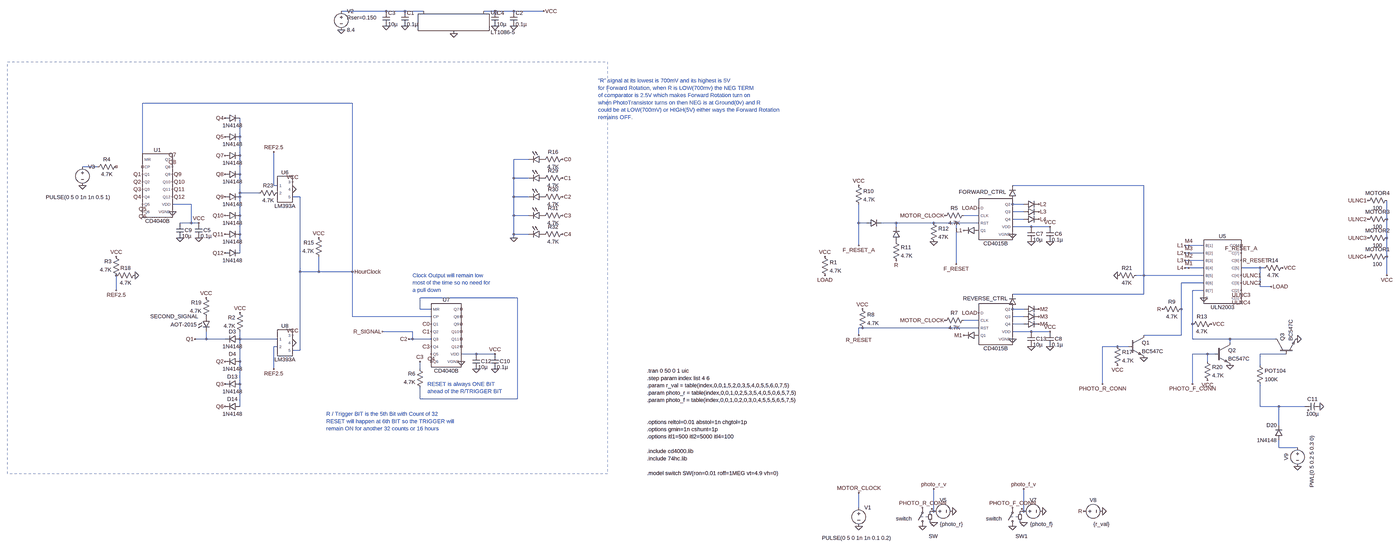
[diagram p0: schematic Draft5_CompleteULN2003_use.asc, whole sheet]
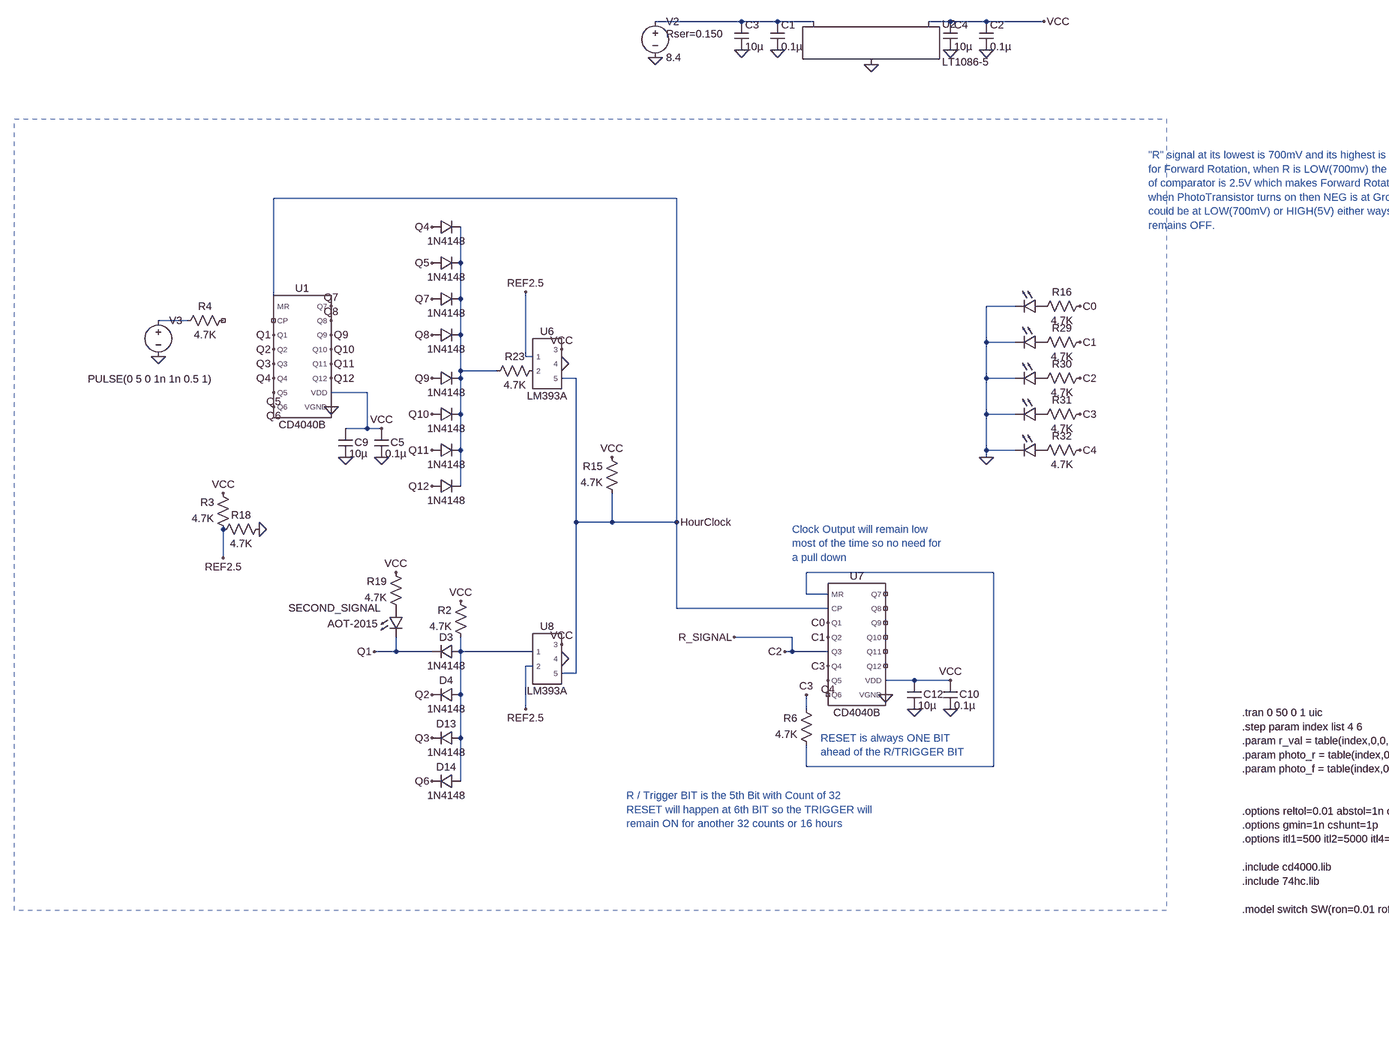
[diagram p1: schematic Draft5_CompleteULN2003_use.asc, part, row 1 of 1, column 1 of 2]
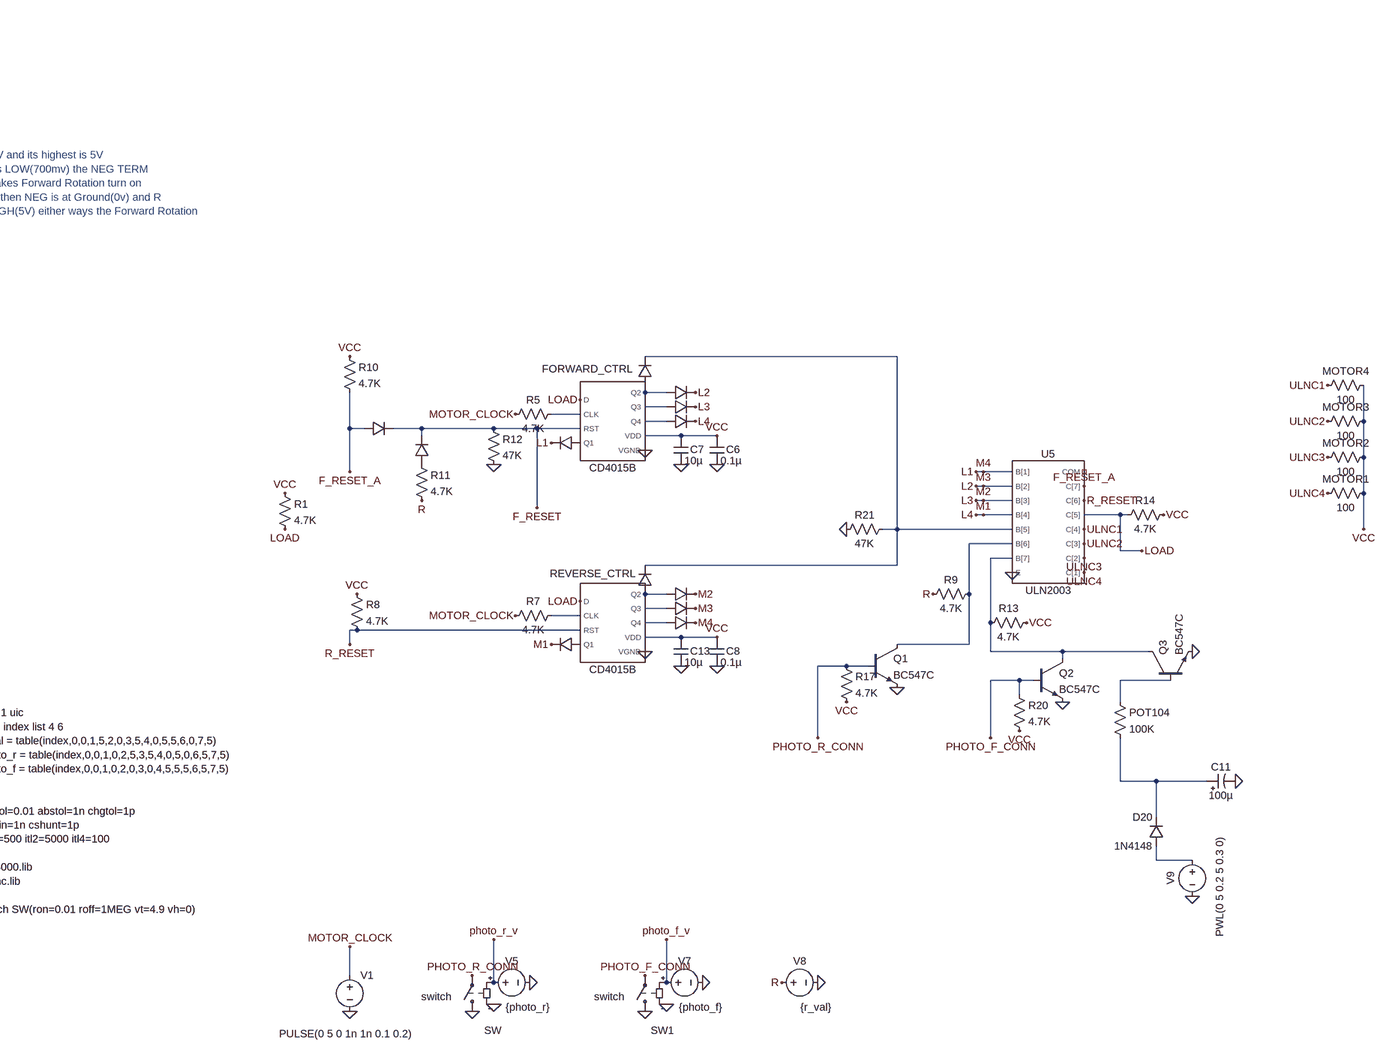
[diagram p2: schematic Draft5_CompleteULN2003_use.asc, part, row 1 of 1, column 2 of 2]
Draft5_CompleteULN2003_use.asc, the LTspice schematic file:
Version 4
SHEET 1 3268 2312
WIRE -1248 -1328 -1440 -1328
WIRE -1168 -1328 -1248 -1328
WIRE -1088 -1328 -1168 -1328
WIRE -784 -1328 -832 -1328
WIRE -704 -1328 -784 -1328
WIRE -576 -1328 -704 -1328
WIRE -1392 -448 -2288 -448
WIRE -1872 -304 -1872 -384
WIRE -1872 -224 -1872 -304
WIRE -2288 -208 -2288 -448
WIRE -640 -208 -704 -208
WIRE -2480 -176 -2544 -176
WIRE -1872 -144 -1872 -224
WIRE -704 -128 -704 -208
WIRE -640 -128 -704 -128
WIRE -1728 -96 -1728 -240
WIRE -1712 -96 -1728 -96
WIRE 1984 -96 1424 -96
WIRE -1872 -64 -1872 -144
WIRE -1792 -64 -1872 -64
WIRE -1872 -48 -1872 -64
WIRE -1616 -48 -1648 -48
WIRE -704 -48 -704 -128
WIRE -640 -48 -704 -48
WIRE -2080 -16 -2160 -16
WIRE 1424 -16 1424 -32
WIRE 1472 -16 1424 -16
WIRE 1472 16 1424 16
WIRE -1872 32 -1872 -48
WIRE -704 32 -704 -48
WIRE -640 32 -704 32
WIRE 1280 32 1216 32
WIRE 1472 48 1424 48
WIRE 3056 48 3056 -32
WIRE -2080 64 -2080 -16
WIRE -2080 64 -2128 64
WIRE -2048 64 -2080 64
WIRE 768 64 768 -16
WIRE 800 64 768 64
WIRE 928 64 864 64
WIRE 1088 64 928 64
WIRE 1184 64 1088 64
WIRE 1280 64 1184 64
WIRE 928 80 928 64
WIRE 1504 80 1424 80
WIRE 1584 80 1504 80
WIRE -1872 112 -1872 32
WIRE -704 112 -704 32
WIRE -640 112 -704 112
WIRE -704 128 -704 112
WIRE 3056 128 3056 48
WIRE 768 160 768 64
WIRE 2176 160 2160 160
WIRE 2240 160 2176 160
WIRE -1872 192 -1872 112
WIRE 2176 192 2160 192
WIRE 2240 192 2176 192
WIRE 3056 208 3056 128
WIRE 2176 224 2160 224
WIRE 2240 224 2176 224
WIRE 1184 240 1184 64
WIRE 2176 256 2160 256
WIRE 2240 256 2176 256
WIRE 2480 256 2400 256
WIRE 2496 256 2480 256
WIRE -1616 272 -1616 -48
WIRE -1536 272 -1536 208
WIRE -1536 272 -1616 272
WIRE -1392 272 -1392 -448
WIRE -1392 272 -1536 272
WIRE 1984 288 1984 -96
WIRE 1984 288 1952 288
WIRE 2240 288 1984 288
WIRE 3056 288 3056 208
WIRE 2240 320 2144 320
WIRE 2480 336 2480 256
WIRE 2528 336 2480 336
WIRE -2400 352 -2400 288
WIRE 2240 352 2192 352
WIRE 1984 368 1984 288
WIRE 1984 368 1424 368
WIRE -688 384 -1104 384
WIRE -1104 432 -1104 384
WIRE -1056 432 -1104 432
WIRE 1472 432 1424 432
WIRE 2144 432 2144 320
WIRE -1392 464 -1392 272
WIRE -1056 464 -1392 464
WIRE 1472 464 1424 464
WIRE 1280 480 1216 480
WIRE 1472 496 1424 496
WIRE 2192 496 2192 352
WIRE 784 512 768 512
WIRE 1280 512 784 512
WIRE -1136 528 -1264 528
WIRE 1504 528 1424 528
WIRE 1584 528 1504 528
WIRE 768 544 768 512
WIRE 2144 544 2144 432
WIRE 2144 544 1984 544
WIRE -2016 560 -2016 528
WIRE -2016 560 -2064 560
WIRE -1936 560 -2016 560
WIRE -1872 560 -1872 528
WIRE -1712 560 -1872 560
WIRE -1136 560 -1136 528
WIRE -1136 560 -1152 560
WIRE -1056 560 -1136 560
WIRE 2192 560 2192 496
WIRE 2352 560 2192 560
WIRE 2544 560 2352 560
WIRE 2352 576 2352 560
WIRE -1712 592 -1728 592
WIRE 1872 592 1808 592
WIRE 1920 592 1872 592
WIRE -1616 608 -1616 272
WIRE -1616 608 -1648 608
WIRE -864 624 -928 624
WIRE -784 624 -864 624
WIRE 2256 624 2192 624
WIRE 2288 624 2256 624
WIRE 2592 624 2480 624
WIRE -1872 656 -1872 560
WIRE 2256 656 2256 624
WIRE 2480 672 2480 624
WIRE -1728 688 -1728 592
WIRE -1104 688 -1104 656
WIRE -1872 752 -1872 656
WIRE 1808 752 1808 592
WIRE 2192 752 2192 624
WIRE -1104 816 -1104 768
WIRE -688 816 -688 384
WIRE -688 816 -1104 816
WIRE -1872 848 -1872 752
WIRE 2480 848 2480 752
WIRE 2560 848 2480 848
WIRE 2672 848 2560 848
WIRE 2560 928 2560 848
WIRE 2560 1024 2560 992
WIRE 2640 1024 2560 1024
WIRE 768 1280 768 1216
WIRE 1088 1296 1088 1200
WIRE 1472 1296 1472 1200
FLAG -1248 -1264 0
FLAG -1168 -1264 0
FLAG -960 -1232 0
FLAG -784 -1264 0
FLAG -704 -1264 0
FLAG -1440 -1248 0
FLAG -576 -1328 VCC
FLAG -2160 16 0
FLAG -1936 -384 Q4
FLAG -1936 -304 Q5
FLAG -2288 -144 Q1
FLAG -2288 -112 Q2
FLAG -2288 -80 Q3
FLAG -2288 -48 Q4
FLAG -2288 -16 Q5
FLAG -2288 16 Q6
FLAG -2160 -208 Q7
FLAG -2160 -176 Q8
FLAG -2160 -144 Q9
FLAG -2160 -112 Q10
FLAG -2160 -80 Q11
FLAG -2160 -48 Q12
FLAG 1040 1360 0
FLAG -2064 560 Q1
FLAG -1936 656 Q2
FLAG -1936 752 Q3
FLAG -1936 848 Q6
FLAG -1936 -224 Q7
FLAG -1936 -144 Q8
FLAG -1936 -48 Q9
FLAG -1936 32 Q10
FLAG -1936 112 Q11
FLAG -1936 192 Q12
FLAG 1088 1344 0
FLAG -2544 -96 0
FLAG -2400 208 VCC
FLAG -1872 448 VCC
FLAG -2048 64 VCC
FLAG -2128 128 0
FLAG -2048 128 0
FLAG -864 688 0
FLAG -784 688 0
FLAG -928 656 0
FLAG -2016 384 VCC
FLAG -1056 496 C0
FLAG -1056 528 C1
FLAG -1056 592 C3
FLAG -1056 624 C4
FLAG -784 624 VCC
FLAG 1504 144 0
FLAG 1584 144 0
FLAG 1584 80 VCC
FLAG 1424 112 0
FLAG 1536 -16 L2
FLAG 1536 48 L4
FLAG 1504 592 0
FLAG 1584 592 0
FLAG 1584 528 VCC
FLAG 1424 560 0
FLAG 1536 432 M2
FLAG 1536 464 M3
FLAG 1536 496 M4
FLAG 1536 16 L3
FLAG 2240 384 0
FLAG 768 1360 0
FLAG 768 1216 MOTOR_CLOCK
FLAG 3056 288 VCC
FLAG 2160 160 L1
FLAG 2160 192 L2
FLAG 2160 224 L3
FLAG 2160 256 L4
FLAG 2176 160 M4
FLAG 2176 192 M3
FLAG 2176 224 M2
FLAG 2176 256 M1
FLAG -1152 560 C2
FLAG -2320 288 0
FLAG -1648 -112 VCC
FLAG -1648 -80 0
FLAG -1648 544 VCC
FLAG -1648 576 0
FLAG -1536 128 VCC
FLAG -1392 272 HourClock
FLAG -496 -208 C0
FLAG -496 -128 C1
FLAG -496 -48 C2
FLAG -496 32 C3
FLAG -496 112 C4
FLAG -1104 656 C3
FLAG -2400 352 REF2.5
FLAG -1728 -240 REF2.5
FLAG -1728 688 REF2.5
FLAG 1168 1296 0
FLAG -1264 528 R_SIGNAL
FLAG -704 128 0
FLAG 2976 -32 ULNC1
FLAG 2976 48 ULNC2
FLAG 2976 128 ULNC3
FLAG 2976 208 ULNC4
FLAG 2400 384 ULNC4
FLAG 2400 352 ULNC3
FLAG 2400 320 ULNC2
FLAG 2400 288 ULNC1
FLAG 624 208 VCC
FLAG 624 288 LOAD
FLAG 2528 336 LOAD
FLAG 1280 0 LOAD
FLAG 1280 448 LOAD
FLAG 1136 32 MOTOR_CLOCK
FLAG 1136 480 MOTOR_CLOCK
FLAG 1216 96 L1
FLAG 1216 544 M1
FLAG 784 432 VCC
FLAG 768 544 R_RESET
FLAG 2400 224 R_RESET
FLAG 2064 432 R
FLAG 1808 752 PHOTO_R_CONN
FLAG 768 -96 VCC
FLAG 928 224 R
FLAG 2400 192 F_RESET_A
FLAG 2272 496 VCC
FLAG 2192 752 PHOTO_F_CONN
FLAG 1040 1280 PHOTO_R_CONN
FLAG 1424 1360 0
FLAG 1472 1344 0
FLAG 1552 1296 0
FLAG 1424 1280 PHOTO_F_CONN
FLAG 1808 1296 0
FLAG 1728 1296 R
FLAG 1472 1200 photo_f_v
FLAG 1088 1200 photo_r_v
FLAG 768 160 F_RESET_A
FLAG 2736 848 0
FLAG 2640 1104 0
FLAG 2576 256 VCC
FLAG 1088 144 0
FLAG 1984 640 0
FLAG 1872 672 VCC
FLAG 2256 736 VCC
FLAG 2352 672 0
FLAG 2640 560 0
FLAG 1184 240 F_RESET
FLAG 1872 288 0
SYMBOL CD4040B -2224 -96 R0
WINDOW 39 0 160 Invisible 2
SYMATTR InstName U1
SYMATTR Value2 vdd=5 speed=1 tripdt=5n
SYMBOL PowerProducts\\LT1086-5 -960 -1328 R0
SYMATTR InstName U2
SYMBOL cap -1184 -1328 R0
SYMATTR InstName C1
SYMATTR Value 0.1µ
SYMATTR SpiceLine V=25 Irms=0 Rser=0.025 Lser=800p mfg="Würth Elektronik" pn="885012206071 WCAP-CSGP 0603" type="X7R"
SYMBOL cap -1264 -1328 R0
SYMATTR InstName C3
SYMATTR Value 10µ
SYMATTR SpiceLine V=25 Irms=0 Rser=0 Lser=0 mfg="Murata" pn="GRM21BR61E106KA73" type="X5R"
SYMBOL cap -720 -1328 R0
SYMATTR InstName C2
SYMATTR Value 0.1µ
SYMATTR SpiceLine V=25 Irms=0 Rser=0.025 Lser=800p mfg="Würth Elektronik" pn="885012206071 WCAP-CSGP 0603" type="X7R"
SYMBOL cap -800 -1328 R0
SYMATTR InstName C4
SYMATTR Value 10µ
SYMATTR SpiceLine V=25 Irms=0 Rser=0 Lser=0 mfg="Murata" pn="GRM21BR61E106KA73" type="X5R"
SYMBOL voltage -1440 -1344 R0
WINDOW 123 0 0 Left 0
WINDOW 39 24 44 Left 2
SYMATTR SpiceLine Rser=0.150
SYMATTR InstName V2
SYMATTR Value 8.4
SYMBOL diode -1936 -368 R270
WINDOW 0 32 32 Invisible 2
WINDOW 3 0 32 VBottom 2
SYMATTR InstName D5
SYMATTR Value 1N4148
SYMBOL diode -1936 -288 R270
WINDOW 0 32 32 Invisible 2
WINDOW 3 0 32 VBottom 2
SYMATTR InstName D6
SYMATTR Value 1N4148
SYMBOL diode -1936 -208 R270
WINDOW 0 32 32 Invisible 2
WINDOW 3 0 32 VBottom 2
SYMATTR InstName D7
SYMATTR Value 1N4148
SYMBOL diode -1936 -128 R270
WINDOW 0 32 32 Invisible 2
WINDOW 3 0 32 VBottom 2
SYMATTR InstName D8
SYMATTR Value 1N4148
SYMBOL diode -1936 -32 R270
WINDOW 0 32 32 Invisible 2
WINDOW 3 0 32 VBottom 2
SYMATTR InstName D9
SYMATTR Value 1N4148
SYMBOL diode -1936 48 R270
WINDOW 0 32 32 Invisible 2
WINDOW 3 0 32 VBottom 2
SYMATTR InstName D10
SYMATTR Value 1N4148
SYMBOL diode -1936 128 R270
WINDOW 0 32 32 Invisible 2
WINDOW 3 0 32 VBottom 2
SYMATTR InstName D11
SYMATTR Value 1N4148
SYMBOL diode -1936 208 R270
WINDOW 0 32 32 Invisible 2
WINDOW 3 0 32 VBottom 2
SYMATTR InstName D12
SYMATTR Value 1N4148
SYMBOL res -2384 -192 R90
WINDOW 0 0 56 VBottom 2
WINDOW 3 32 56 VTop 2
SYMATTR InstName R4
SYMATTR Value 4.7K
SYMBOL ULN2003 2320 272 R0
SYMATTR InstName U5
SYMBOL sw 1040 1376 R180
WINDOW 3 46 49 Left 2
WINDOW 0 -65 -26 Left 2
SYMATTR Value switch
SYMATTR InstName SW
SYMBOL voltage -2544 -192 R0
WINDOW 3 -157 146 Left 2
WINDOW 123 0 0 Left 0
WINDOW 39 0 0 Left 0
SYMATTR Value PULSE(0 5 0 1n 1n 0.5 1)
SYMATTR InstName V3
SYMBOL res -2384 304 R180
WINDOW 0 36 76 Left 2
WINDOW 3 36 40 Left 2
SYMATTR InstName R3
SYMATTR Value 4.7K
SYMBOL diode -1872 544 R90
WINDOW 0 0 32 VBottom 2
WINDOW 3 32 32 VTop 2
SYMATTR InstName D3
SYMATTR Value 1N4148
SYMBOL diode -1872 640 R90
WINDOW 0 0 32 VBottom 2
WINDOW 3 32 32 VTop 2
SYMATTR InstName D4
SYMATTR Value 1N4148
SYMBOL diode -1872 736 R90
WINDOW 0 0 32 VBottom 2
WINDOW 3 32 32 VTop 2
SYMATTR InstName D13
SYMATTR Value 1N4148
SYMBOL diode -1872 832 R90
WINDOW 0 0 32 VBottom 2
WINDOW 3 32 32 VTop 2
SYMATTR InstName D14
SYMATTR Value 1N4148
SYMBOL res -1856 544 R180
WINDOW 0 36 76 Left 2
WINDOW 3 36 40 Left 2
SYMATTR InstName R2
SYMATTR Value 4.7K
SYMBOL res -1520 224 R180
WINDOW 0 36 76 Left 2
WINDOW 3 36 40 Left 2
SYMATTR InstName R15
SYMATTR Value 4.7K
SYMBOL CD4040B -992 544 R0
WINDOW 39 0 160 Invisible 2
SYMATTR InstName U7
SYMATTR Value2 vdd=5 speed=1 tripdt=5n
SYMBOL cap -2064 64 R0
WINDOW 0 36 31 Left 2
SYMATTR InstName C5
SYMATTR Value 0.1µ
SYMATTR SpiceLine V=25 Irms=0 Rser=0.025 Lser=800p mfg="Würth Elektronik" pn="885012206071 WCAP-CSGP 0603" type="X7R"
SYMBOL cap -2144 64 R0
WINDOW 0 36 31 Left 2
SYMATTR InstName C9
SYMATTR Value 10µ
SYMATTR SpiceLine V=25 Irms=0 Rser=0 Lser=0 mfg="Murata" pn="GRM21BR61E106KA73" type="X5R"
SYMBOL cap -800 624 R0
WINDOW 0 36 31 Left 2
SYMATTR InstName C10
SYMATTR Value 0.1µ
SYMATTR SpiceLine V=25 Irms=0 Rser=0.025 Lser=800p mfg="Würth Elektronik" pn="885012206071 WCAP-CSGP 0603" type="X7R"
SYMBOL cap -880 624 R0
WINDOW 0 36 31 Left 2
SYMATTR InstName C12
SYMATTR Value 10µ
SYMATTR SpiceLine V=25 Irms=0 Rser=0 Lser=0 mfg="Murata" pn="GRM21BR61E106KA73" type="X5R"
SYMBOL res -1088 784 R180
WINDOW 0 36 76 Left 2
WINDOW 3 36 40 Left 2
SYMATTR InstName R6
SYMATTR Value 4.7K
SYMBOL res -2000 480 R180
WINDOW 0 36 76 Left 2
WINDOW 3 36 40 Left 2
SYMATTR InstName R19
SYMATTR Value 4.7K
SYMBOL LED -2032 464 R0
WINDOW 0 -223 -1 Left 2
WINDOW 3 -136 34 Left 2
SYMATTR InstName SECOND_SIGNAL
SYMATTR Value AOT-2015
SYMBOL CD4015B 1344 48 R0
WINDOW 39 8 112 Invisible 2
WINDOW 0 -49 -101 Bottom 2
SYMATTR InstName FORWARD_CTRL
SYMATTR Value2 vdd=5 speed=1 tripdt=5n
SYMBOL cap 1568 80 R0
WINDOW 0 36 31 Left 2
SYMATTR InstName C6
SYMATTR Value 0.1µ
SYMATTR SpiceLine V=25 Irms=0 Rser=0.025 Lser=800p mfg="Würth Elektronik" pn="885012206071 WCAP-CSGP 0603" type="X7R"
SYMBOL cap 1488 80 R0
WINDOW 0 36 31 Left 2
SYMATTR InstName C7
SYMATTR Value 10µ
SYMATTR SpiceLine V=25 Irms=0 Rser=0 Lser=0 mfg="Murata" pn="GRM21BR61E106KA73" type="X5R"
SYMBOL CD4015B 1344 496 R0
WINDOW 39 8 112 Invisible 2
WINDOW 0 -36 -94 Bottom 2
SYMATTR InstName REVERSE_CTRL
SYMATTR Value2 vdd=5 speed=1 tripdt=5n
SYMBOL cap 1568 528 R0
WINDOW 0 36 31 Left 2
SYMATTR InstName C8
SYMATTR Value 0.1µ
SYMATTR SpiceLine V=25 Irms=0 Rser=0.025 Lser=800p mfg="Würth Elektronik" pn="885012206071 WCAP-CSGP 0603" type="X7R"
SYMBOL cap 1488 528 R0
WINDOW 0 36 31 Left 2
SYMATTR InstName C13
SYMATTR Value 10µ
SYMATTR SpiceLine V=25 Irms=0 Rser=0 Lser=0 mfg="Murata" pn="GRM21BR61E106KA73" type="X5R"
SYMBOL diode 1472 0 R270
WINDOW 0 32 32 Invisible 2
WINDOW 3 0 32 Invisible 2
SYMATTR InstName D21
SYMATTR Value 1N4148
SYMBOL diode 1472 32 R270
WINDOW 0 32 32 Invisible 2
WINDOW 3 0 32 Invisible 2
SYMATTR InstName D22
SYMATTR Value 1N4148
SYMBOL diode 1472 64 R270
WINDOW 0 32 32 Invisible 2
WINDOW 3 0 32 Invisible 2
SYMATTR InstName D23
SYMATTR Value 1N4148
SYMBOL diode 1472 448 R270
WINDOW 0 32 32 Invisible 2
WINDOW 3 0 32 Invisible 2
SYMATTR InstName D24
SYMATTR Value 1N4148
SYMBOL diode 1472 480 R270
WINDOW 0 32 32 Invisible 2
WINDOW 3 0 32 Invisible 2
SYMATTR InstName D25
SYMATTR Value 1N4148
SYMBOL diode 1472 512 R270
WINDOW 0 32 32 Invisible 2
WINDOW 3 0 32 Invisible 2
SYMATTR InstName D26
SYMATTR Value 1N4148
SYMBOL voltage 768 1264 R0
WINDOW 3 -157 146 Left 2
WINDOW 123 0 0 Left 0
WINDOW 39 0 0 Left 0
SYMATTR Value PULSE(0 5 0 1n 1n 0.1 0.2)
SYMATTR InstName V1
SYMBOL res 3072 192 R90
WINDOW 0 0 56 VBottom 2
WINDOW 3 32 56 VTop 2
SYMATTR InstName MOTOR1
SYMATTR Value 100
SYMBOL res 3072 112 R90
WINDOW 0 0 56 VBottom 2
WINDOW 3 32 56 VTop 2
SYMATTR InstName MOTOR2
SYMATTR Value 100
SYMBOL res 3072 32 R90
WINDOW 0 0 56 VBottom 2
WINDOW 3 32 56 VTop 2
SYMATTR InstName MOTOR3
SYMATTR Value 100
SYMBOL res 3072 -48 R90
WINDOW 0 0 56 VBottom 2
WINDOW 3 32 56 VTop 2
SYMATTR InstName MOTOR4
SYMATTR Value 100
SYMBOL diode 1440 -32 R180
WINDOW 0 24 64 Invisible 2
WINDOW 3 24 0 Invisible 2
SYMATTR InstName D2
SYMATTR Value 1N4148
SYMBOL diode 1440 432 R180
WINDOW 0 24 64 Invisible 2
WINDOW 3 24 0 Invisible 2
SYMATTR InstName D16
SYMATTR Value 1N4148
SYMBOL LM393A -1680 -80 R0
SYMATTR InstName U6
SYMBOL res -2416 304 R270
WINDOW 0 32 56 VTop 2
WINDOW 3 0 56 VBottom 2
SYMATTR InstName R18
SYMATTR Value 4.7K
SYMBOL LM393A -1680 576 R0
SYMATTR InstName U8
SYMBOL LED -576 -224 R90
WINDOW 0 0 32 Invisible 2
WINDOW 3 72 32 Invisible 2
SYMATTR InstName D35
SYMATTR Value NSPW500BS
SYMATTR Description Diode
SYMATTR Type diode
SYMBOL LED -576 -144 R90
WINDOW 0 0 32 Invisible 2
WINDOW 3 72 32 Invisible 2
SYMATTR InstName D36
SYMATTR Value NSPW500BS
SYMATTR Description Diode
SYMATTR Type diode
SYMBOL LED -576 -64 R90
WINDOW 0 0 32 Invisible 2
WINDOW 3 72 32 Invisible 2
SYMATTR InstName D37
SYMATTR Value NSPW500BS
SYMATTR Description Diode
SYMATTR Type diode
SYMBOL LED -576 16 R90
WINDOW 0 0 32 Invisible 2
WINDOW 3 72 32 Invisible 2
SYMATTR InstName D38
SYMATTR Value NSPW500BS
SYMATTR Description Diode
SYMATTR Type diode
SYMBOL LED -576 96 R90
WINDOW 0 0 32 Invisible 2
WINDOW 3 72 32 Invisible 2
SYMATTR InstName D39
SYMATTR Value NSPW500BS
SYMATTR Description Diode
SYMATTR Type diode
SYMBOL res -480 -224 R90
WINDOW 0 0 56 VBottom 2
WINDOW 3 32 56 VTop 2
SYMATTR InstName R16
SYMATTR Value 4.7K
SYMBOL res -480 -144 R90
WINDOW 0 0 56 VBottom 2
WINDOW 3 32 56 VTop 2
SYMATTR InstName R29
SYMATTR Value 4.7K
SYMBOL res -480 -64 R90
WINDOW 0 0 56 VBottom 2
WINDOW 3 32 56 VTop 2
SYMATTR InstName R30
SYMATTR Value 4.7K
SYMBOL res -480 16 R90
WINDOW 0 0 56 VBottom 2
WINDOW 3 32 56 VTop 2
SYMATTR InstName R31
SYMATTR Value 4.7K
SYMBOL res -480 96 R90
WINDOW 0 0 56 VBottom 2
WINDOW 3 32 56 VTop 2
SYMATTR InstName R32
SYMATTR Value 4.7K
SYMBOL res -1696 -80 R90
WINDOW 0 0 56 VBottom 2
WINDOW 3 32 56 VTop 2
SYMATTR InstName R23
SYMATTR Value 4.7K
SYMBOL voltage 1072 1296 R270
WINDOW 0 32 56 VTop 2
WINDOW 3 -39 92 VBottom 2
SYMATTR InstName V5
SYMATTR Value {photo_r}
SYMBOL res 608 192 R0
SYMATTR InstName R1
SYMATTR Value 4.7K
SYMBOL res 1232 16 R90
WINDOW 0 0 56 VBottom 2
WINDOW 3 32 56 VTop 2
SYMATTR InstName R5
SYMATTR Value 4.7K
SYMBOL res 1232 464 R90
WINDOW 0 0 56 VBottom 2
WINDOW 3 32 56 VTop 2
SYMATTR InstName R7
SYMATTR Value 4.7K
SYMBOL diode 1280 80 R90
WINDOW 0 0 32 Invisible 2
WINDOW 3 32 32 Invisible 2
SYMATTR InstName D1
SYMATTR Value 1N4148
SYMBOL diode 1280 528 R90
WINDOW 0 0 32 Invisible 2
WINDOW 3 32 32 Invisible 2
SYMATTR InstName D15
SYMATTR Value 1N4148
SYMBOL res 768 416 R0
SYMATTR InstName R8
SYMATTR Value 4.7K
SYMBOL res 2160 416 R90
WINDOW 0 0 56 VBottom 2
WINDOW 3 32 56 VTop 2
SYMATTR InstName R9
SYMATTR Value 4.7K
SYMBOL res 752 -112 R0
SYMATTR InstName R10
SYMATTR Value 4.7K
SYMBOL res 912 128 R0
SYMATTR InstName R11
SYMATTR Value 4.7K
SYMBOL diode 800 80 R270
WINDOW 0 32 32 Invisible 2
WINDOW 3 0 32 Invisible 2
SYMATTR InstName D18
SYMATTR Value 1N4148
SYMBOL diode 944 144 R180
WINDOW 0 24 64 Invisible 2
WINDOW 3 24 0 Invisible 2
SYMATTR InstName D19
SYMATTR Value 1N4148
SYMBOL res 1072 48 R0
SYMATTR InstName R12
SYMATTR Value 47K
SYMBOL res 2288 480 R90
WINDOW 0 0 56 VBottom 2
WINDOW 3 32 56 VTop 2
SYMATTR InstName R13
SYMATTR Value 4.7K
SYMBOL sw 1424 1376 R180
WINDOW 3 46 49 Left 2
WINDOW 0 -65 -26 Left 2
SYMATTR Value switch
SYMATTR InstName SW1
SYMBOL voltage 1456 1296 R270
WINDOW 0 32 56 VTop 2
WINDOW 3 -39 92 VBottom 2
SYMATTR InstName V7
SYMATTR Value {photo_f}
SYMBOL voltage 1712 1296 R270
WINDOW 0 32 56 VTop 2
WINDOW 3 -39 92 VBottom 2
SYMATTR InstName V8
SYMATTR Value {r_val}
SYMBOL polcap 2672 864 R270
WINDOW 0 32 32 VTop 2
WINDOW 3 0 32 VBottom 2
SYMATTR InstName C11
SYMATTR Value 100µ
SYMATTR SpiceLine V=25 Irms=520m Rser=0.087 Lser=27.6n
SYMBOL voltage 2640 1008 R0
WINDOW 0 -32 56 VBottom 2
WINDOW 3 46 74 VTop 2
WINDOW 123 0 0 Left 0
WINDOW 39 0 0 Left 0
SYMATTR InstName V9
SYMATTR Value PWL(0 5 0.2 5 0.3 0)
SYMBOL diode 2576 992 R180
WINDOW 0 24 64 Left 2
WINDOW 3 24 0 Left 2
SYMATTR InstName D20
SYMATTR Value 1N4148
SYMBOL res 2592 240 R90
WINDOW 0 0 56 VBottom 2
WINDOW 3 32 56 VTop 2
SYMATTR InstName R14
SYMATTR Value 4.7K
SYMBOL res 2464 656 R0
SYMATTR InstName POT104
SYMATTR Value 100K
SYMBOL npn 1920 544 R0
SYMATTR InstName Q1
SYMATTR Value BC547C
SYMBOL res 1856 576 R0
SYMATTR InstName R17
SYMATTR Value 4.7K
SYMBOL npn 2288 576 R0
SYMATTR InstName Q2
SYMATTR Value BC547C
SYMBOL res 2240 640 R0
SYMATTR InstName R20
SYMATTR Value 4.7K
SYMBOL npn 2544 624 R270
SYMATTR InstName Q3
SYMATTR Value BC547C
SYMBOL res 1968 272 R90
WINDOW 0 0 56 VBottom 2
WINDOW 3 32 56 VTop 2
SYMATTR InstName R21
SYMATTR Value 47K
TEXT -136 696 Left 2 !.tran 0 50 0 1 uic\n.step param index list 4 6\n.param r_val = table(index,0,0,1,5,2,0,3,5,4,0,5,5,6,0,7,5)\n.param photo_r = table(index,0,0,1,0,2,5,3,5,4,0,5,0,6,5,7,5)\n.param photo_f = table(index,0,0,1,0,2,0,3,0,4,5,5,5,6,5,7,5)\n \n \n.options reltol=0.01 abstol=1n chgtol=1p\n.options gmin=1n cshunt=1p\n.options itl1=500 itl2=5000 itl4=100\n \n.include cd4000.lib\n.include 74hc.lib\n \n.model switch SW(ron=0.01 roff=1MEG vt=4.9 vh=0)
TEXT -1504 880 Left 2 ;R / Trigger BIT is the 5th Bit with Count of 32 \nRESET will happen at 6th BIT so the TRIGGER will \nremain ON for another 32 counts or 16 hours
TEXT -1072 752 Left 2 ;RESET is always ONE BIT \nahead of the R/TRIGGER BIT
TEXT -1136 288 Left 2 ;Clock Output will remain low \nmost of the time so no need for \na pull down
TEXT -344 -544 Left 2 ;"R" signal at its lowest is 700mV and its highest is 5V\nfor Forward Rotation, when R is LOW(700mv) the NEG TERM \nof comparator is 2.5V which makes Forward Rotation turn on \nwhen PhotoTransistor turns on then NEG is at Ground(0v) and R\ncould be at LOW(700mV) or HIGH(5V) either ways the Forward Rotation\nremains OFF.
RECTANGLE Normal -304 1136 -2864 -624 2

The netlist it stands for:
* Draft5_CompleteULN2003_use.asc
XU1 HourClock NC_01 Q1 Q2 Q3 Q4 Q5 Q6 Q7 Q8 Q9 Q10 Q11 Q12 VCC 0 CD4040B vdd=5 speed=1 tripdt=5n vdd1={vdd} speed1={speed} tripdt1={tripdt}  ; pins MR CP Q1 Q2 Q3 Q4 Q5 Q6 Q7 Q8 Q9 Q10 Q11 Q12 VDD VGND
XU2 0 VCC N001 LT1086-5
C1 N001 0 0.1µ V=25 Irms=0 Rser=0.025 Lser=800p mfg="Würth Elektronik" pn="885012206071 WCAP-CSGP 0603" type="X7R"
C3 N001 0 10µ V=25 Irms=0 Rser=0 Lser=0 mfg="Murata" pn="GRM21BR61E106KA73" type="X5R"
C2 VCC 0 0.1µ V=25 Irms=0 Rser=0.025 Lser=800p mfg="Würth Elektronik" pn="885012206071 WCAP-CSGP 0603" type="X7R"
C4 VCC 0 10µ V=25 Irms=0 Rser=0 Lser=0 mfg="Murata" pn="GRM21BR61E106KA73" type="X5R"
V2 N001 0 8.4 Rser=0.150
D5 Q4 N002 1N4148
D6 Q5 N002 1N4148
D7 Q7 N002 1N4148
D8 Q8 N002 1N4148
D9 Q9 N002 1N4148
D10 Q10 N002 1N4148
D11 Q11 N002 1N4148
D12 Q12 N002 1N4148
R4 NC_02 N003 4.7K
XU5 L1 M3 L3 M1 N004 N009 N010 0 NC_03 F_RESET_A R_RESET LOAD ULNC1 ULNC2 ULNC3 ULNC4 ULN2003  ; pins B[1] B[2] B[3] B[4] B[5] B[6] B[7] E COM C[7] C[6] C[5] C[4] C[3] C[2] C[1]
SW 0 PHOTO_R_CONN photo_r_v 0 switch
V3 N003 0 PULSE(0 5 0 1n 1n 0.5 1)
R3 REF2.5 VCC 4.7K
D3 N016 Q1 1N4148
D4 N016 Q2 1N4148
D13 N016 Q3 1N4148
D14 N016 Q6 1N4148
R2 N016 VCC 4.7K
R15 HourClock VCC 4.7K
XU7 N011 HourClock C0 C1 R_SIGNAL C3 C4 NC_04 NC_05 NC_06 NC_07 NC_08 NC_09 NC_10 VCC 0 CD4040B vdd=5 speed=1 tripdt=5n vdd1={vdd} speed1={speed} tripdt1={tripdt}  ; pins MR CP Q1 Q2 Q3 Q4 Q5 Q6 Q7 Q8 Q9 Q10 Q11 Q12 VDD VGND
C5 VCC 0 0.1µ V=25 Irms=0 Rser=0.025 Lser=800p mfg="Würth Elektronik" pn="885012206071 WCAP-CSGP 0603" type="X7R"
C9 VCC 0 10µ V=25 Irms=0 Rser=0 Lser=0 mfg="Murata" pn="GRM21BR61E106KA73" type="X5R"
C10 VCC 0 0.1µ V=25 Irms=0 Rser=0.025 Lser=800p mfg="Würth Elektronik" pn="885012206071 WCAP-CSGP 0603" type="X7R"
C12 VCC 0 10µ V=25 Irms=0 Rser=0 Lser=0 mfg="Murata" pn="GRM21BR61E106KA73" type="X5R"
R6 N011 C3 4.7K
R19 P001 VCC 4.7K
D§SECOND_SIGNAL P001 Q1 AOT-2015
XFORWARD_CTRL LOAD N007 F_RESET P002 N005 N006 N008 VCC 0 CD4015B vdd=5 speed=1 tripdt=5n vdd1={vdd} speed1={speed} tripdt1={tripdt}  ; pins D CLK RST Q1 Q2 Q3 Q4 VDD VGND
C6 VCC 0 0.1µ V=25 Irms=0 Rser=0.025 Lser=800p mfg="Würth Elektronik" pn="885012206071 WCAP-CSGP 0603" type="X7R"
C7 VCC 0 10µ V=25 Irms=0 Rser=0 Lser=0 mfg="Murata" pn="GRM21BR61E106KA73" type="X5R"
XREVERSE_CTRL LOAD N014 R_RESET P003 N012 N013 N015 VCC 0 CD4015B vdd=5 speed=1 tripdt=5n vdd1={vdd} speed1={speed} tripdt1={tripdt}  ; pins D CLK RST Q1 Q2 Q3 Q4 VDD VGND
C8 VCC 0 0.1µ V=25 Irms=0 Rser=0.025 Lser=800p mfg="Würth Elektronik" pn="885012206071 WCAP-CSGP 0603" type="X7R"
C13 VCC 0 10µ V=25 Irms=0 Rser=0 Lser=0 mfg="Murata" pn="GRM21BR61E106KA73" type="X5R"
D21 N005 M3 1N4148
D22 N006 L3 1N4148
D23 N008 M1 1N4148
D24 N012 L3 1N4148
D25 N013 M3 1N4148
D26 N015 L1 1N4148
V1 MOTOR_CLOCK 0 PULSE(0 5 0 1n 1n 0.1 0.2)
R§MOTOR1 VCC ULNC4 100
R§MOTOR2 VCC ULNC3 100
R§MOTOR3 VCC ULNC2 100
R§MOTOR4 VCC ULNC1 100
D2 N005 N004 1N4148
D16 N012 N004 1N4148
XU6 REF2.5 P004 VCC 0 HourClock LM393A  ; pins 1 2 3 4 5
R18 REF2.5 0 4.7K
XU8 N016 REF2.5 VCC 0 HourClock LM393A  ; pins 1 2 3 4 5
D35 P005 0 NSPW500BS
D36 P006 0 NSPW500BS
D37 P007 0 NSPW500BS
D38 P008 0 NSPW500BS
D39 P009 0 NSPW500BS
R16 C0 P005 4.7K
R29 C1 P006 4.7K
R30 R_SIGNAL P007 4.7K
R31 C3 P008 4.7K
R32 C4 P009 4.7K
R23 P004 N002 4.7K
V5 photo_r_v 0 {photo_r}
R1 VCC LOAD 4.7K
R5 N007 MOTOR_CLOCK 4.7K
R7 N014 MOTOR_CLOCK 4.7K
D1 P002 L1 1N4148
D15 P003 M1 1N4148
R8 VCC R_RESET 4.7K
R9 N009 R 4.7K
R10 VCC F_RESET_A 4.7K
R11 P010 R 4.7K
D18 F_RESET_A F_RESET 1N4148
D19 P010 F_RESET 1N4148
R12 F_RESET 0 47K
R13 VCC N010 4.7K
SW1 0 PHOTO_F_CONN photo_f_v 0 switch
V7 photo_f_v 0 {photo_f}
V8 R 0 {r_val}
C11 N018 0 100µ V=25 Irms=520m Rser=0.087 Lser=27.6n
V9 N019 0 PWL(0 5 0.2 5 0.3 0)
D20 N019 N018 1N4148
R14 VCC LOAD 4.7K
R§POT104 N017 N018 100K
Q1 N009 PHOTO_R_CONN 0 0 BC547C
R17 PHOTO_R_CONN VCC 4.7K
Q2 N010 PHOTO_F_CONN 0 0 BC547C
R20 PHOTO_F_CONN VCC 4.7K
Q3 N010 N017 0 0 BC547C
R21 N004 0 47K
.model D D
.lib standard.dio
.model NPN NPN
.model PNP PNP
.lib standard.bjt
.tran 0 50 0 1 uic
.step param index list 4 6
.param r_val = table(index,0,0,1,5,2,0,3,5,4,0,5,5,6,0,7,5)
.param photo_r = table(index,0,0,1,0,2,5,3,5,4,0,5,0,6,5,7,5)
.param photo_f = table(index,0,0,1,0,2,0,3,0,4,5,5,5,6,5,7,5)
.options reltol=0.01 abstol=1n chgtol=1p
.options gmin=1n cshunt=1p
.options itl1=500 itl2=5000 itl4=100
.include cd4000.lib
.include 74hc.lib
.model switch SW(ron=0.01 roff=1MEG vt=4.9 vh=0)
* R / Trigger BIT is the 5th Bit with Count of 32
* RESET will happen at 6th BIT so the TRIGGER will
* remain ON for another 32 counts or 16 hours
* RESET is always ONE BIT
* ahead of the R/TRIGGER BIT
* Clock Output will remain low
* most of the time so no need for
* a pull down
* "R" signal at its lowest is 700mV and its highest is 5V
* for Forward Rotation, when R is LOW(700mv) the NEG TERM
* of comparator is 2.5V which makes Forward Rotation turn on
* when PhotoTransistor turns on then NEG is at Ground(0v) and R
* could be at LOW(700mV) or HIGH(5V) either ways the Forward Rotation
* remains OFF.
.lib CD4000.lib
.lib C:\Users\Parmeet Singh Ghai\Documents\GitHub\AutomatedLockSystem\LTSpice\ULN2003.lib
.lib C:\Users\Parmeet Singh Ghai\Documents\GitHub\AutomatedLockSystem\LTSpice\CD4015B.sub
.lib C:\Users\Parmeet Singh Ghai\Documents\GitHub\AutomatedLockSystem\LTSpice\LM393A.sub
.backanno
.end